# EAGLE design SunnyBuddy (EAGLE 9.6.2)

## Sheet 1 of 4
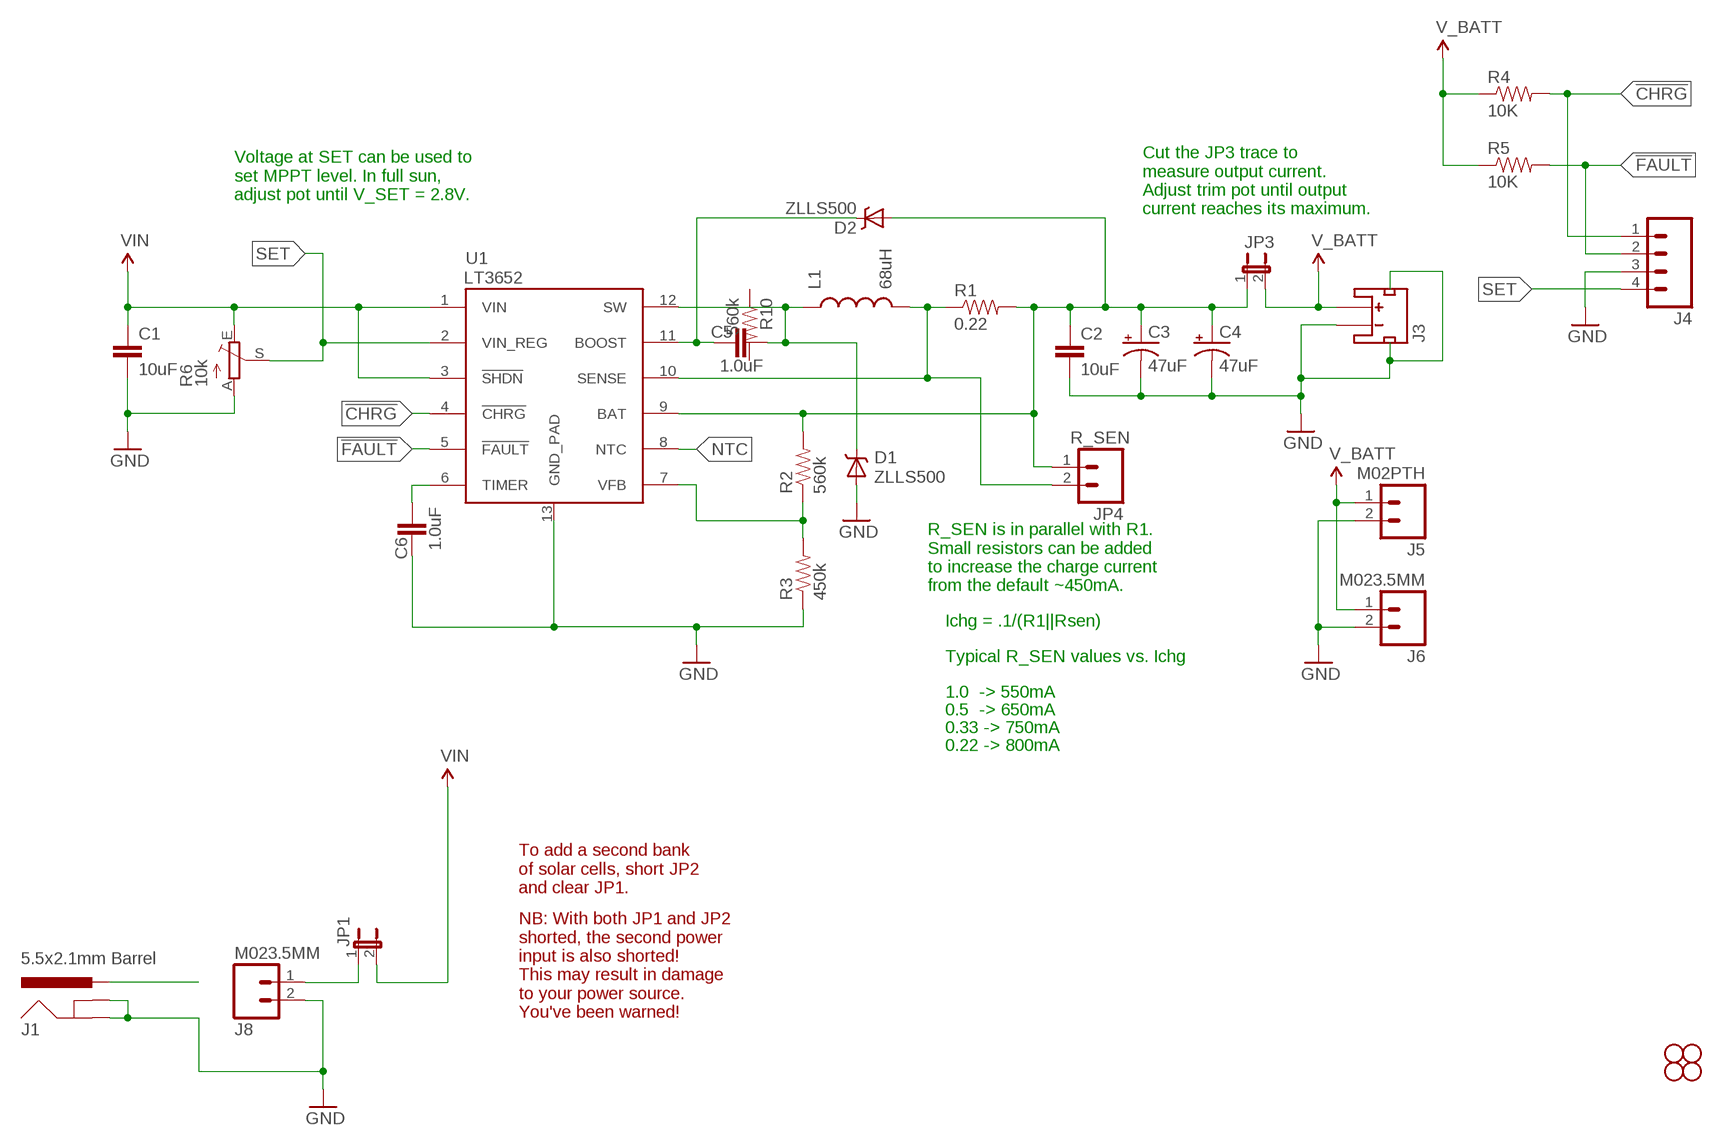
[diagram p0: schematic, sheet 1]

### Parts
C1  10uF  10UF50V20%(1210)  [1210]
C2  10uF  10UF-6.3V-20%(1206)  [1206]
C3  47uF  47UF-TANT  [EIA3528]
C4  47uF  47UF-TANT  [EIA3528]
C5  1.0uF  1.0UF-16V-10%(0603)  [0603-CAP]
C6  1.0uF  1.0UF-16V-10%(0603)  [0603-CAP]
D1  ZLLS500  ZLLS500ZLLS500  [SOT23]
D2  ZLLS500  ZLLS500ZLLS500  [SOT23]
J1  5.5x2.1mm Barrel  POWER_JACKSMD  [POWER_JACK_SMD]
J3  JST_2MM_MALE  [JST-2-SMD]
J4  M04PTH  [1X04]
J5  M02PTH  [1X02]
J6  M023.5MM  [SCREWTERMINAL-3.5MM-2]
J8  M023.5MM  [SCREWTERMINAL-3.5MM-2]
JP1  JUMPER-2SMD-NC  [SJ_2S]
JP3  JUMPER-PTH-2-NC  [PTH-JUMPER-NC_BOTTOM_NO_SILK]
JP4  R_SEN  M02PTH  [1X02]
L1  68uH  INDUCTOR68UH-1A  [CR75]
R1  0.22  0.22OHM1/4W1%(0805)  [0805]
R2  560k  47KOHM1/10W1%(0603)  [0603-RES]
R3  450k  220KOHM1/10W1%(0603)  [0603-RES]
R4  10K  10KOHM1/10W1%(0603)0603  [0603-RES]
R5  10K  10KOHM1/10W1%(0603)0603  [0603-RES]
R6  10k  TRIM_EU-S63S  [S63S]
R10  560k  47KOHM1/10W1%(0603)  [0603-RES]
STANDOFF1  STAND-OFF  [STAND-OFF]
STANDOFF2  STAND-OFF  [STAND-OFF]
STANDOFF3  STAND-OFF  [STAND-OFF]
STANDOFF4  STAND-OFF  [STAND-OFF]
U1  LT3652  [MSOP-12_GND]

### Nets
!CHRG: J4.1 R4.2 U1.4(!CHRG)
!FAULT: J4.2 R5.2 U1.5(!FAULT)
BOOST: C5.1 D2.3(C) U1.11(BOOST)
FB: R2.1 R3.2 U1.7(VFB)
GND: C1.2 C2.2 C3.C(-) C4.C(-) C6.1 D1.1(A) J1.GND(GNDBREAK) J1.P$4(GND) J3.1(-) J3.NC1(PAD1) J3.NC2(PAD2) J4.3 J5.2 J6.2 J8.2 R3.1 R6.A U1.13(GND_PAD)
N$4: C2.1 C3.A(+) C4.A(+) D2.1(A) JP3.1 JP4.1 R1.2 R2.2 U1.9(BAT)
N$6: J1.VIN0(PWR)
N$8: J8.1 JP1.1
NTC: U1.8(NTC)
SENSE: JP4.2 L1.P$2 R1.1 U1.10(SENSE)
SET: J4.4 R6.S U1.2(VIN_REG)
SW: C5.2 D1.3(C) L1.P$1 U1.12(SW)
TIMER: C6.2 U1.6(TIMER)
V_BATT: J3.2(+) J5.1 J6.1 JP3.2 R4.1 R5.1 ; also sheet 2
VIN: C1.1 JP1.2 R6.E U1.1(VIN) U1.3(!SHDN)
Unconnected: R10.1 R10.2

### Notes on the sheet
- Voltage at SET can be used to
  set MPPT level. In full sun,
  adjust pot until V_SET = 2.8V.
- Cut the JP3 trace to
  measure output current.
  Adjust trim pot until output
  current reaches its maximum.
- R_SEN is in parallel with R1.
  Small resistors can be added
  to increase the charge current
  from the default ~450mA.
- Ichg = .1/(R1||Rsen)
- Typical R_SEN values vs. Ichg
- 1.0  -> 550mA
- 0.5  -> 650mA
- 0.33 -> 750mA
- 0.22 -> 800mA
- To add a second bank
  of solar cells, short JP2
  and clear JP1.
- NB: With both JP1 and JP2
  shorted, the second power
  input is also shorted! 
  This may result in damage
  to your power source.
  You've been warned!

## Sheet 2 of 4
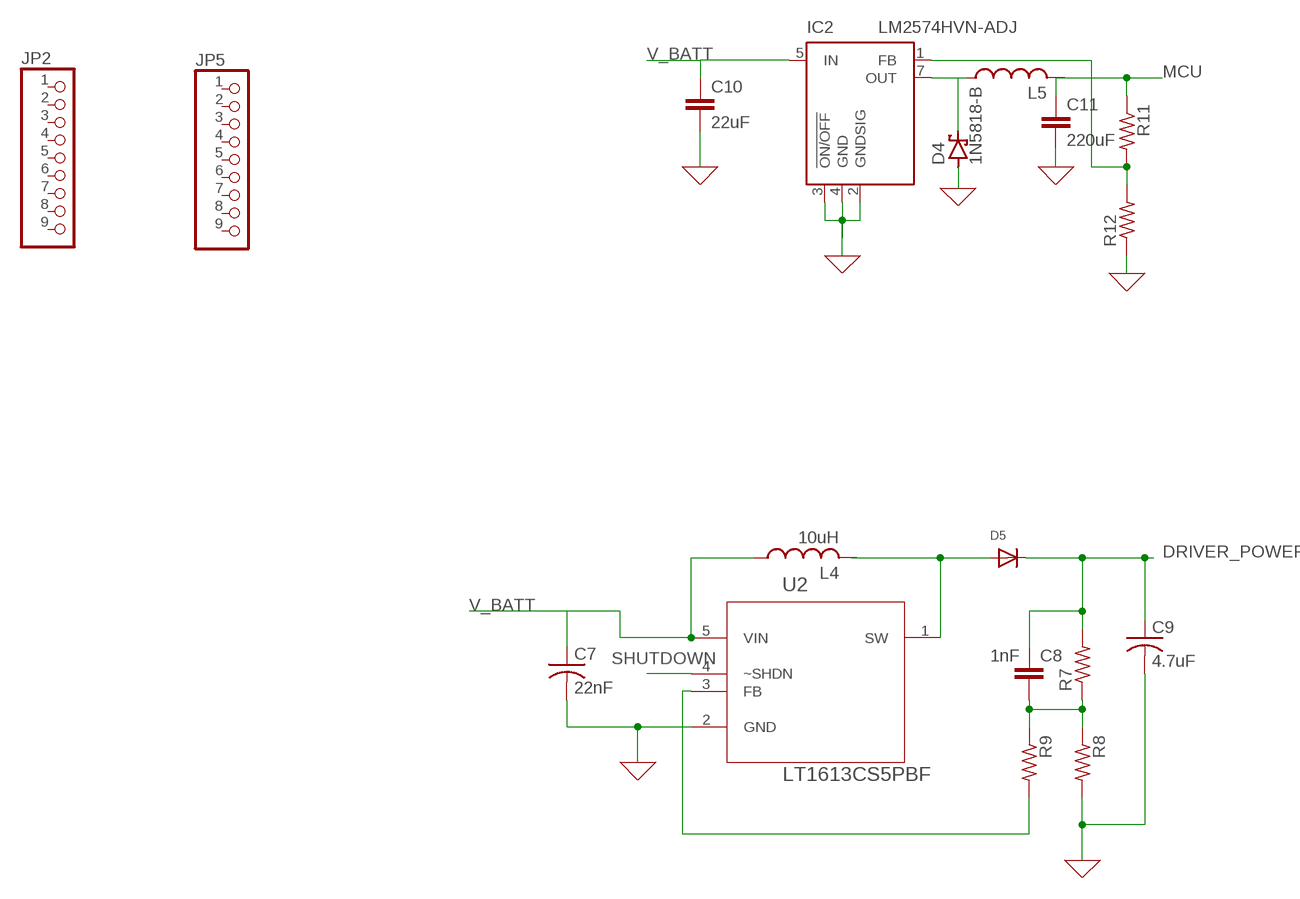
[diagram p1: schematic, sheet 2]

### Parts
C7  22nF  C-US050-045X075  [C050-045X075]
C8  1nF  C5/2.5  [C5B2.5]
C9  4.7uF  C-US025-024X044  [C025-024X044]
C10  22uF  C2,5-3  [C2.5-3]
C11  220uF  C2,5-3  [C2.5-3]
D4  1N5818-B  [DO41-7.6]
D5  DIODESOD-123  [SOD-123]
IC2  LM2574HVN-ADJ  [DIL08]
JP2  PINHD-1X9  [1X09-BIG]
JP5  PINHD-1X9  [1X09-BIG]
L4  10uH  L-US0207/5V  [0207/5V]
L5  L-US0207/5V  [0207/5V]
R7  R-US_0204/5  [0204/5]
R8  R-US_0204/5  [0204/5]
R9  R-US_0204/5  [0204/5]
R11  R-US_0204/7  [0204/7]
R12  R-US_0204/7  [0204/7]
U2  LT1613CS5PBF  [SOT95P280X145-5N]

### Nets
0: C7.2 C9.2 C10.2 C11.2 D4.A R8.2 R12.1 U2.2(GND) ; supply symbol labelled GND
DRIVER_POWER: C8.1 C9.1 D5.C R7.2
MCU: C11.1 L5.2 R11.1
N$3: IC2.2(GNDSIG) IC2.3(!ON/OFF) IC2.4(GND) ; supply symbol labelled GND
N$5: IC2.1(FB) R11.2 R12.2
N$7: R9.2 U2.3(FB)
N$9: D5.A L4.2 U2.1(SW)
N$10: D4.C IC2.7(OUT) L5.1
N$11: C8.2 R7.1 R8.1 R9.1
SHUTDOWN: U2.4(~SHDN)
V_BATT: C7.1 C10.1 IC2.5(IN) L4.1 U2.5(VIN) ; also sheet 1
Unconnected: JP2.1 JP2.2 JP2.3 JP2.4 JP2.5 JP2.6 JP2.7 JP2.8 JP2.9 JP5.1 JP5.2 JP5.3 JP5.4 JP5.5 JP5.6 JP5.7 JP5.8 JP5.9

## Sheet 3 of 4

## Sheet 4 of 4

## Library data of the parts
C1 = SparkFun-Capacitors:10UF50V20%(1210): CAP-09824; PROD_ID: CAP-09824
C2 = SparkFun-Capacitors:10UF-6.3V-20%(1206): Ceramic CAP-10057; PROD_ID: CAP-10057
C3 C4 = SparkFun-Capacitors:47UF-TANT: 47uF Tantalum SMT CAP-08310- 10V 10% (EIA-3528); PROD_ID: CAP-08310
C5 C6 = SparkFun-Capacitors:1.0UF-16V-10%(0603): CAP-00868; PROD_ID: CAP-00868
C7 C9 = rcl:C-US: CAPACITOR, American symbol; SPICEPREFIX: C
C8 C10 C11 = capacitor-wima:C: CAPACITOR naming: grid - package width
D1 D2 = SparkFun-DiscreteSemi:ZLLS500: 700mA 40V SOT-23 Schottky; PROD_ID: DIO-08411
D4 = diode:1N581*: 1.0A SCHOTTKY BARRIER RECTIFIER Source: http://www.diodes.com/datasheets/ds23001.pdf
D5 = adafruit:DIODE: Diode SMADIODE - SMA Surface Mount Package 20V 1A Schottky Diode Digikey: 641-1014-6-ND DO-1N4148 - Through Hole Small Current Diode SOD-123 20V 1 A (.5mV Vf) Schottky Diode - Digikey: MBRX120TPMSCT-ND SOD-323 10V 570mA (.38mV Vf, 3ns) Schottky Diode - Digikey: ZLLS410CT-ND SOD-523 30V 30mA Schottky Diode (RB751S-40TE61) - Digikey: RB751S-40TE61CT-ND SOT23-R/W - SOT23 Package (R = Solder Paste/Reflow Ovens, W = Hand-Soldering) BAT54Film 40V 300mA - Digikey: 497-7162-1-ND
IC2 = linear:LM2574?-*: SIMPLE SWITCHER 0.5A Step-Down Voltage Regulator Source: http://cache.national.com/ds/LM/LM2574.pdf
J1 = SparkFun-Connectors:POWER_JACK: Power Jack This is the standard 5.5mm barrel jack for power. The PTH is the most common, proven, reliable, footprint. The Slot footprint only works if the mill layer is transmitted to the PCB fab house so be warned. Spark Fun Electronics SKU : PRT-00119 SMT: CONN-08106 Mating wall wart : TOL-00298 (and others); PROD_ID: CONN-08106
J3 = SparkFun-Connectors:JST_2MM_MALE: Mates to single-cell LiPo batteries. CONN-08352; PROD_ID: CONN-08352
J4 = SparkFun-Connectors:M04: Header 4 Standard 4-pin 0.1" header. Use with straight break away headers (SKU : PRT-00116), right angle break away headers (PRT-00553), swiss pins (PRT-00743), machine pins (PRT-00117), and female headers (PRT-00115). Molex polarized connector foot print use with SKU : PRT-08231 with associated crimp pins and housings. 1MM SMD Version SKU: PRT-10208
J5 J6 J8 JP4 = SparkFun-Connectors:M02: Standard 2-pin 0.1" header. Use with - straight break away headers ( PRT-00116) - right angle break away headers (PRT-00553) - swiss pins (PRT-00743) - machine pins (PRT-00117) - female headers (PRT-00115) Molex polarized connector foot print use with: PRT-08233 with associated crimp pins and housings. 2.54_SCREWTERM for use with PRT-10571. 3.5mm Screw Terminal footprints for PRT-08084 5mm Screw Terminal footprints for use with PRT-08433
JP1 = SparkFun-Passives:JUMPER-2: Jumper Basic 0.1" spaced jumper. Use with breakaway headers.
JP2 JP5 = adafruit:PINHD-1X9: Pin header 1x10 0.1" spacing With round pins
JP3 = SparkFun-Passives:JUMPER-PTH-2-NC
L1 = SparkFun-Passives:INDUCTOR: Inductors Basic Inductor/Choke - 0603 and 1206. Footprints are not proven and vary greatly between part numbers. SRN6045- 33uH, 20% 1.4A SDR0403-560KL - 56uH, 10%, 500mA RMS/740mA peak; PROD_ID: NDUC-09739
L4 L5 = rcl:L-US: INDUCTOR, American symbol; SPICEPREFIX: L
R1 = SparkFun-Resistors:0.22OHM1/4W1%(0805): RES-09883; PROD_ID: RES-09883
R2 R10 = SparkFun-Resistors:47KOHM1/10W1%(0603): RES-07871; PROD_ID: RES-07871; VALUE: 47K
R3 = SparkFun-Resistors:220KOHM1/10W1%(0603): RES-08969; PROD_ID: RES-08969; VALUE: 220k
R4 R5 = SparkFun-Resistors:10KOHM1/10W1%(0603): RES-00824; PROD_ID: RES-00824
R6 = pot:TRIM_EU-: POTENTIOMETER
R7-R9 R11 R12 = rcl:R-US_: RESISTOR, American symbol; SPICEPREFIX: R
STANDOFF1-STANDOFF4 = SparkFun-Electromechanical:STAND-OFF: #4 Stand Off This is the mechanical footprint for a #4 phillips button head screw. Use the keepout ring to avoid running the screw head into surrounding components. SKU : PRT-00447
U1 = SparkFun-PowerIC:LT3652: LT3652 MPPT Solar Charge Controller 5V-32V smart charger for batteries up to 14.4V
U2 = LTC_By_element14_Batch_1:LT1613CS5PBF: DC/DC Converter; MPN: LT1613CS5#PBF; OC_FARNELL: 1531483; OC_NEWARK: 61M3347; PACKAGE: SOT-23-5; SUPPLIER: Linear Technology

## Board
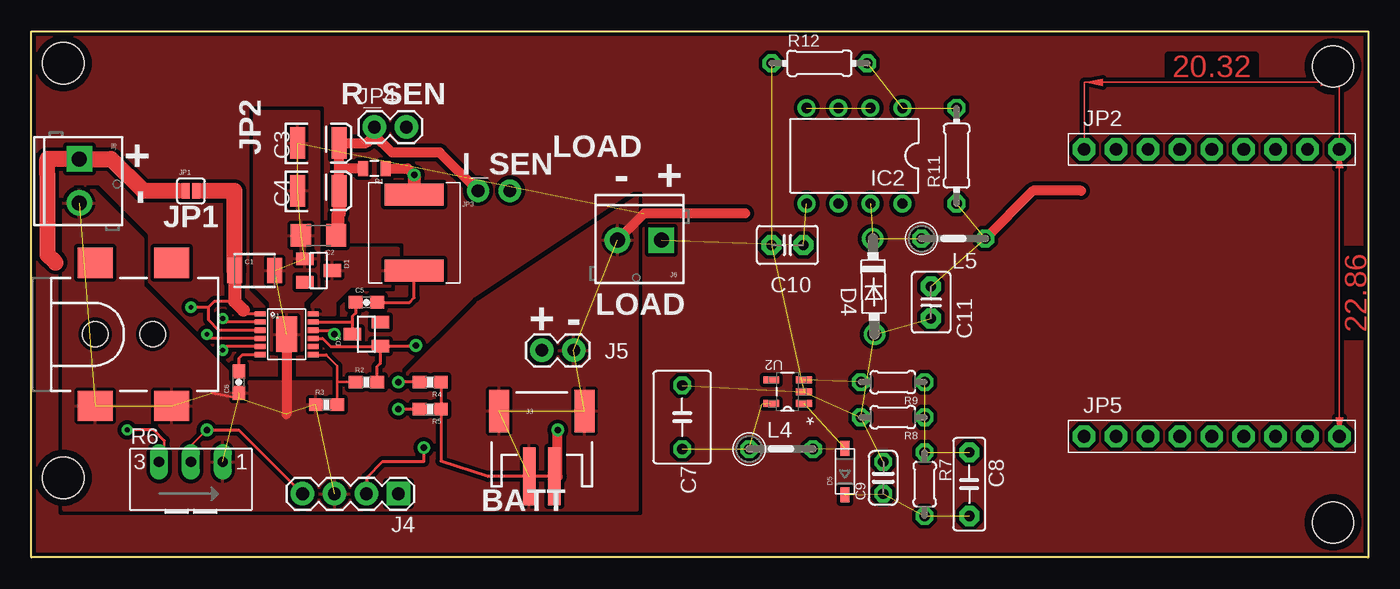
[diagram p2: board, top side]
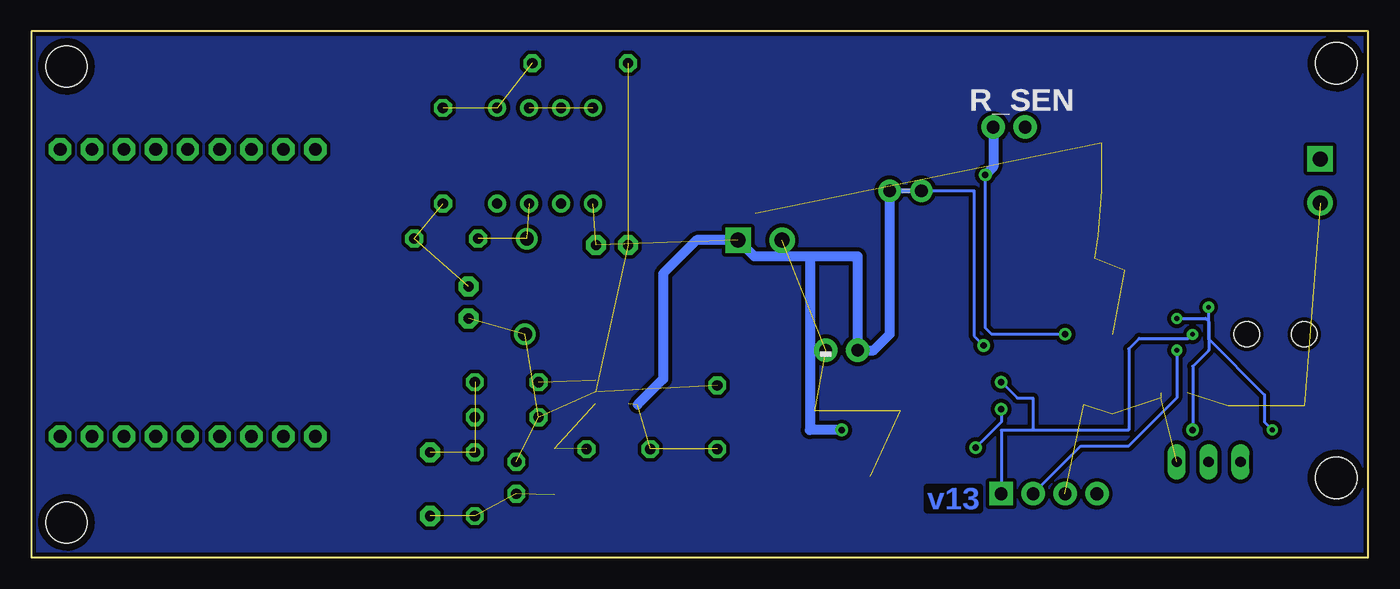
[diagram p3: board, bottom side, seen from below]

Size 106.43 x 41.91 mm. Coordinates in mm from the lower left corner, seen from the top.
Outline: 0,41.91 106.43,41.91 106.43,0 0,0 0,41.91
Copper layers (1*16): Top 0.035mm / dielectric 1.5mm / Bottom 0.035mm
Design rules "Sparkfun": minimum track width 8mil, minimum drill 20mil, track to track 8mil, track to pad 8mil, pad to pad 8mil, via to via 8mil, smd to smd 8mil, copper to edge 8mil, drill to drill 8mil, minimum pad ring 12mil, minimum via ring 10mil, stop-mask expansion 4mil, vias tented up to drill 20mil, thermal gap 10mil

### Footprints (pad centres in the part's own frame; a part is rotated, then mirrored left to right if it is on the bottom)
1210 = smd 1.2 x 2: 1 -1.6,0; 2 1.6,0
1206 = smd 1.6 x 1.8: 1 -1.4,0; 2 1.4,0
EIA3528 = smd 1.2 x 2.5: A 1.65,0; C -1.65,0
0603-CAP = smd 1.1 x 1: 1 -0.85,0; 2 0.85,0
C050-045X075 = drill 0.813 octagon: 1 -2.54,0; 2 2.54,0
C5B2.5 = drill 0.813 pad 1.6 octagon: 1 -2.54,0; 2 2.54,0
C025-024X044 = drill 0.813 octagon: 1 -1.27,0; 2 1.27,0
C2.5-3 = drill 0.813 pad 1.6 octagon: 1 -1.27,0; 2 1.27,0
SOT23 = smd 1 x 1.4: 1 -0.95,-1.1; 2 0.95,-1.1; 3 0,1.1
DO41-7.6 = drill 1.1 pad 1.7: A 3.81,0; C -3.81,0
SOD-123 = smd 1.2 x 0.7: A 1.85,0; C -1.85,0
DIL08 = drill 0.813 pad 1.27: 1 -3.81,-3.81; 2 -1.27,-3.81; 3 1.27,-3.81; 4 3.81,-3.81; 5 3.81,3.81; 6 1.27,3.81; 7 -1.27,3.81; 8 -3.81,3.81
POWER_JACK_SMD = smd 2.8 x 2.4: GND 0,-5.7; P$4 6.1,-5.7; VIN0 0,5.7; VIN1 6.1,5.7 | hole 2.032: 0,0; 4.572,0
JST-2-SMD = smd 1 x 4.6: 1 -1,-3.7; 2 1,-3.7 | smd 1.6 x 3.4: NC1 -3.4,1.5; NC2 3.4,1.5
1X04 = drill 1.016 pad 1.88 square: 1 0,0 | drill 1.016 pad 1.88: 2 2.54,0; 3 5.08,0; 4 7.62,0
1X02 = drill 1.016 pad 1.88: 1 0,0; 2 2.54,0
SCREWTERMINAL-3.5MM-2 = drill 1.2 pad 2.032 square: 1 0,0 | drill 1.2 pad 2.032: 2 3.5,0
SJ_2S = smd 0.635 x 1.27: 1 -0.412,0; 2 0.412,0
1X09-BIG = drill 1.016 pad 1.778 octagon: 1 -10.16,0; 2 -7.62,0; 3 -5.08,0; 4 -2.54,0; 5 0,0; 6 2.54,0; 7 5.08,0; 8 7.62,0; 9 10.16,0
PTH-JUMPER-NC_BOTTOM_NO_SILK = drill 1.016 pad 1.778: 1 -1.27,0; 2 1.27,0 | smd 1.27 x 0.381 bottom: P$1 0,0
CR75 = smd 1.75 x 4.7: P$1 0,0; P$2 6.05,0
0207/5V = drill 0.813 octagon: 1 -2.54,0; 2 2.54,0
0805 = smd 0.8 x 1.2: 1 -0.9,0; 2 0.9,0
0603-RES = smd 1.1 x 1: 1 -0.85,0; 2 0.85,0
S63S = drill 0.813 long: A 2.54,1.27; E -2.54,1.27; S 0,1.27
0204/5 = drill 0.813 octagon: 1 -2.54,0; 2 2.54,0
0204/7 = drill 0.813 octagon: 1 -3.81,0; 2 3.81,0
STAND-OFF = hole 3.302: 0,0
MSOP-12_GND = smd 0.889 x 0.42: 1 -2.1,1.625; 2 -2.1,0.975; 3 -2.1,0.325; 4 -2.1,-0.325; 5 -2.1,-0.975; 6 -2.1,-1.625; 7 2.1,-1.625; 8 2.1,-0.975; 9 2.1,-0.325; 10 2.1,0.325; 11 2.1,0.975; 12 2.1,1.625 | smd 1.651 x 2.845: 13 0,0
SOT95P280X145-5N = smd 1.27 x 0.559: 1 -1.295,0.94; 2 -1.295,0; 3 -1.295,-0.94; 4 1.295,-0.94; 5 1.295,0.94

### Placement (x,y rotation side)
C1  17.78,22.86 0 top
C2  22.86,25.65 180 top
C3  22.86,33.02 0 top
C4  22.86,29.21 0 top
C5  26.67,20.32 0 top
C6  16.51,13.97 90 top
C7  51.82,11.18 90 top
C8  74.68,5.84 90 top
C9  67.82,6.35 90 top
C10  60.2,24.89 180 top
C11  71.63,20.32 270 top
D1  22.86,22.86 270 top
D2  26.67,17.78 90 top
D4  67.06,21.59 271.1 top
D5  64.77,6.86 90 top
IC2  65.53,32 180 top
J1  5.08,17.78 0 top
J3  40.64,10.16 0 top
J4  29.21,5.08 180 top
J5  40.64,16.51 0 top
J6  50.16,25.27 180 top
J8  3.81,31.75 270 top
JP1  12.7,29.21 0 top
JP2  93.98,32.51 0 top
JP3  36.83,29.21 0 top
JP4  27.3,34.29 0 top
JP5  93.98,9.65 0 top
L1  30.48,22.86 90 top
L4  59.69,8.64 0 top
L5  73.41,25.4 0 top
R1  27.3,30.99 180 top
R2  26.67,13.97 0 top
R3  23.5,12.19 0 top
R4  31.75,13.97 180 top
R5  31.75,11.81 180 top
R6  12.7,6.35 0 top
R7  71.12,5.84 270 top
R8  68.58,11.18 180 top
R9  68.58,13.97 180 top
R10  54.61,-7.62 0 top  (outside the outline)
R11  73.66,32 90 top
R12  62.74,39.37 0 top
STANDOFF1  2.54,6.35 0 top
STANDOFF2  2.54,39.37 0 top
STANDOFF3  103.63,39.12 0 top
STANDOFF4  103.63,2.79 0 top
U1  20.32,17.78 0 top
U2  60.2,13.21 180 top

### Tracks (layer width: path | path; a pad name or v marks a point on that pad's centre or on a via)
0  (7 unrouted)
!CHRG  (via drill 0.38, 0.51)
  Top 0.254: R4.2 v29.21,13.97 | U1.4 14.29,17.45 v13.97,17.78
  Bottom 0.254: 26.67,10.16 26.67,12.7 27.94,12.7 v29.21,13.97 | J4.1 29.21,10.16 26.67,10.16 | 26.67,10.16 19.05,10.16 19.05,16.62 U1.4 14.29,17.45 v13.97,17.78
!FAULT  (via drill 0.38, 0.51)
  Top 0.254: v31.24,8.76 31.24,7.62 27.94,7.62 26.67,6.35 J4.2 | R5.2 v29.21,11.81 | U1.5 15.54,16.8 v15.24,16.51
  Bottom 0.254: v31.24,8.76 29.21,10.79 v29.21,11.81 | v15.24,16.51 15.24,12.7 19.05,8.89 22.86,8.89 J4.2
BOOST
  Top 0.254: D2.3 25.57,18.67 | 25.57,18.67 25.57,19.22 25.82,19.47 C5.1 | U1.11 25.48,18.75 25.57,18.67
DRIVER_POWER  (3 unrouted)
FB
  Top 0.203: 23.47,16.16 24.34,15.28 24.34,13.97 | 24.34,13.97 R3.2 | R2.1 24.34,13.97
  Top 0.254: U1.7 23.47,16.16
GND  (18 unrouted)
  Top 0.254: 14.39,13.12 16.51,12.7
  Top 0.813: U1.13 20.32,11.43 | 56.83,27.4 48.8,27.4 J6.2
  pour Top (isolate 0.305): 48.26,28.79 35.56,20.32 29.21,13.97 16.51,13.97 8.89,21.59 8.89,25.4 5.08,29.21 2.54,29.21 2.54,3.81 48.26,3.81
  pour Top (isolate 0.305): 22.86,35.56 22.86,21.59 21.59,20.32 21.59,16.51 19.05,16.51 19.05,20.32 17.78,21.59 17.78,35.56
MCU  (2 unrouted)
  Top 0.813: 83.57,29.21 79.76,29.21 L5.2
N$1
  pour Top (isolate 0.305, rank 2, no thermals): 0,41.91 106.43,41.91 106.43,0 0,0
N$2
  pour Bottom (isolate 0.305, rank 2, no thermals): 0,41.91 106.43,41.91 106.43,0 0,0
N$3  (2 unrouted)
N$4  (via drill 0.51)
  Top 0.254: U1.9 23.18,17.45 23.81,16.83 D2.1 | 24.13,25.78 C2.1 | D2.1 27.77,15.45 27.52,15.2 R2.2 | v30.61,16.89 30.55,16.83 D2.1
  Top 0.813: C4.A 24.51,30.99 | 24.51,30.99 C3.A 26.67,33.02 27.3,33.66 | 27.3,33.66 JP4.1 | R1.2 24.51,30.99 | JP3.1 32.51,32.26 28.7,32.26 27.3,33.66
  Top 1.016: C4.A 24.51,27.43 24.38,27.3 24.38,25.78 C2.1
  Bottom 0.254: JP3.1 31.37,29.21 31.37,17.65 v30.61,16.89
N$5  (2 unrouted)
N$7  (1 unrouted)
N$8
  Top 0.254: 11.68,29.21 JP1.1
  Top 1.27: 1.92,23.48 1.27,24.13 1.27,30.48 1.27,31.75 J8.1 6.35,31.75 8.89,29.21 11.68,29.21
N$9  (2 unrouted)
N$10  (2 unrouted)
N$11  (3 unrouted)
SENSE  (via drill 0.51)
  Top 0.254: U1.10 23.8,18.11 v24.13,17.78
  Top 0.813: R1.1 29.97,30.99 v30.48,30.48
  Top 1.016: v30.48,30.48 L1.P$2
  Bottom 0.254: v24.13,17.78 29.97,17.78 30.48,18.29 v30.48,30.48
  Bottom 0.813: JP4.2 29.84,31.11 v30.48,30.48
SET  (via drill 0.38, 0.51)
  Top 0.203: v13.97,10.16 12.7,8.89 R6.S
  Top 0.254: U1.2 15.54,18.75 v15.24,19.05 | J4.4 16.51,10.16 v13.97,10.16
  Bottom 0.254: v15.24,19.05 12.95,19.05 12.7,18.8 12.7,16.51 13.97,15.24 v13.97,10.16
SW
  Top 0.254: C5.2 30.1,20.32 30.48,20.7 L1.P$1
  pour Top (isolate 0.305): 23.5,24.64 29.21,24.64 29.21,22.22 28.57,21.59 25.4,21.59 24.13,20.32 24.13,19.3 22.35,19.3 22.35,20.19 23.5,21.34
TIMER
  Top 0.254: U1.6 16.79,16.16 16.51,15.88 C6.2
V_BATT  (via drill 0.51)  (5 unrouted)
  Top 0.254: R5.1 R4.1 32.6,7.66 36.33,6.46 J3.2
  Top 0.813: J3.2 41.91,6.46 v41.91,10.16
  Bottom 0.813: v41.91,10.16 44.45,10.16 44.45,24 | 44.45,24 48.9,24 J6.1 53.47,25.27 56.13,22.61 56.13,14.22 58.17,12.19 | 44.45,24 40.64,24 J5.1 39.37,16.51 38.1,17.78 JP3.2
VIN  (via drill 0.38)
  Top 0.203: 10.58,9.31 10.58,8.04 R6.E
  Top 0.254: 13.73,29.2 13.72,29.21 JP1.2 | U1.1 17.17,19.41 16.89,19.68 | U1.3 14.91,18.11 14.1,18.92 14.1,19.94 | 14.1,19.94 14.55,20.4 16.18,20.4 | 10.58,9.31 9.73,10.16 v7.62,10.16 | v12.7,19.94 14.1,19.94
  Top 1.016: C1.1 16.18,20.4 16.89,19.68
  Top 1.27: C1.1 16.18,29.2 13.73,29.2
  Bottom 0.254: v7.62,10.16 8.26,10.79 8.26,12.95 12.7,17.4 v12.7,19.94
(copper drawn outside any net)
  shapes: Top area x2

### Text on the board
Bottom: v13
tPlace: R_SEN | JP2 | LOAD | + | - | I_SEN | - | + | JP1 | - | LOAD | + | BATT
bPlace: R_SEN | -